# EasyEDA Pro project Ethernet ACS Toggle.eprj

# Schematic Schematic1
Board Name: Board1; Create Date: 2026-02-21; Page Name: P1; Project Name: Ethernet ACS Toggle; Schematic Name: Schematic1; Update Date: 2026-02-20; Company: EasyEDA.com; Page Size: A4; Version: V1.0
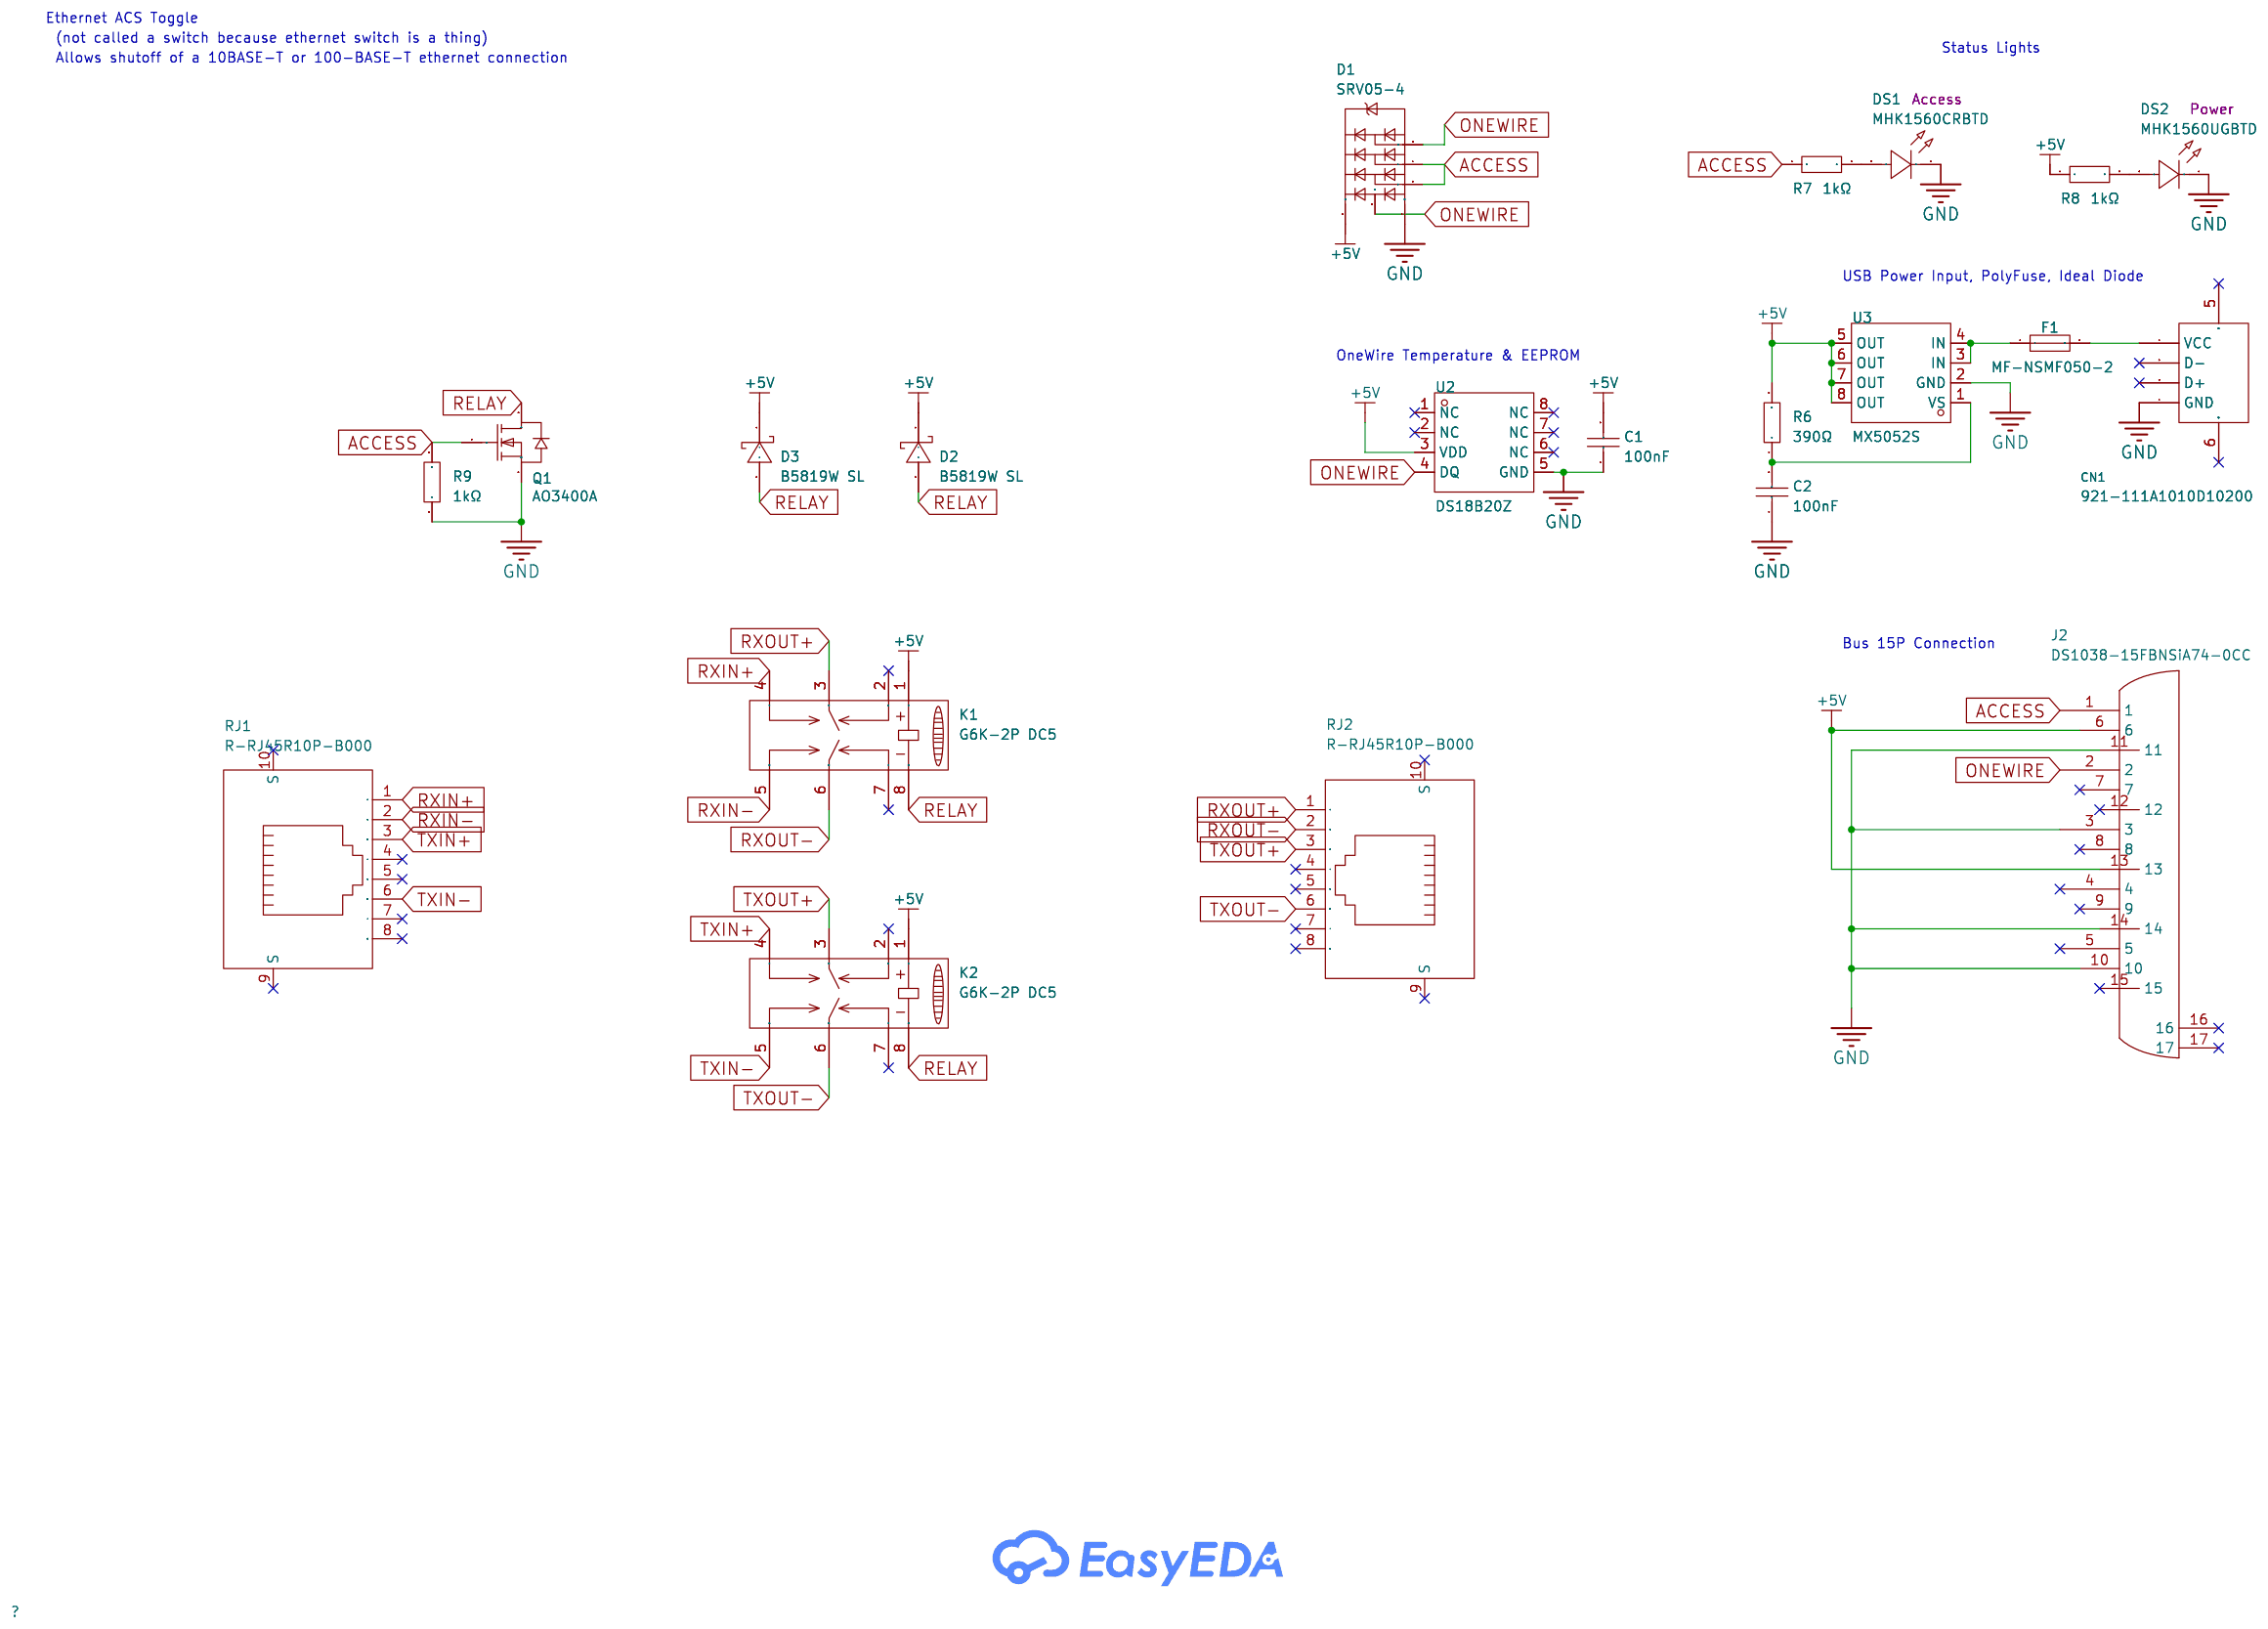
[diagram p0: schematic sheet]

## Parts
C1  100nF  [C0805]
C2  100nF  [C0805]
CN1  921-111A1010D10200  [USB-B_TH_USB-B-FEMALE-90]
D1  SRV05-4  [SOT-23-6_L2.9-W1.6-P0.95-LS2.8-BL-1]
D2  B5819W SL  [SOD-123_L2.7-W1.6-LS3.7-RD-1]
D3  B5819W SL  [SOD-123_L2.7-W1.6-LS3.7-RD-1]
DS1  MHK1560CRBTD  [LED-TH_MHK1560UGBTD]
DS2  MHK1560UGBTD  [LED-TH_MHK1560UGBTD]
F1  MF-NSMF050-2  [F1206]
J2  DS1038-15FBNSiA74-0CC  [DSUB-TH_DS1038-15FBNSIA74-0CC]
K1  G6K-2P DC5  [RELAY-TH_G6K-2P]
K2  G6K-2P DC5  [RELAY-TH_G6K-2P]
Q1  AO3400A  [SOT-23-3_L2.9-W1.3-P1.90-LS2.4-BR]
R6  390Ω  [R0805]
R7  1kΩ  [R0805]
R8  1kΩ  [R0805]
R9  1kΩ  [R0805]
RJ1  R-RJ45R10P-B000  [RJ45-TH_R-RJ45R10P-B000]
RJ2  R-RJ45R10P-B000  [RJ45-TH_R-RJ45R10P-B000]
U2  DS18B20Z  [SOP-8_L4.9-W3.9-P1.27-LS6.0-BL]
U3  MX5052S  [SOP-8_L4.9-W3.9-P1.27-LS6.0-BL]

## Library data of the parts
C1 C2 = CL21B104KCFNNNE: Capacitance:100nF Tolerance:±10% Tolerance:±10% Voltage Rating:100V Temperature Coefficient:X7R; LCSC Part Name: 100nF ±10% 100V; Supplier Part: C28233; Manufacturer: SAMSUNG(三星); Supplier Footprint: 0805; JLCPCB Part Class: Basic Part; Datasheet: https://item.szlcsc.com/datasheet/CL21B104KCFNNNE/28983.html; Supplier: LCSC; Tolerance: ±10%; Voltage Rating: 100V; Temperature Coefficient: X7R
CN1 = 921-111A1010D10200: Connector Type:Type-B Protocol Standard:USB 2.0 Gender:Female Mounting Type:Right Angle Number of Contacts:4P Number of Ports:1 Length:16.3mm Detection color:White; LCSC Part Name: Type-B 母 弯插; Supplier Part: C46392; Manufacturer: 精拓金; Supplier Footprint: 插件; Datasheet: https://item.szlcsc.com/datasheet/921-111A1010D10200/47396.html; Supplier: LCSC; Connector Type: Type-B; Protocol Standard: USB 2.0; Gender: Female; Mounting Type: Right Angle; Number of Contacts: 4P; Number of Ports: 1; Length: 16.3mm; Detection color: White
D1 = SRV05-4_C7420376: LCSC Part Name: 丝印 V05 双向ESD 5V截止 峰值浪涌电流：5A; Supplier Part: C7420376; Manufacturer: R+O(宏嘉诚); Supplier Footprint: SOT-23-6L; Datasheet: https://item.szlcsc.com/datasheet/SRV05-4/8397198.html; Supplier: LCSC; Polarity: Unidirectional; Reverse Stand-Off Voltage (Vrwm): 5V; Clamping Voltage: 15V; Peak Pulse Current (Ipp): 4A; Peak Pulse Power Dissipation (Ppp): 80W; Voltage - Breakdown: 6V; Reverse Leakage Current (Ir): 5uA; Number of Channels: 4; Operating Temperature: -55℃~+150℃; level of protection: IEC 61000-4-2；IEC 61000-4-5; Type: ESD; Junction Capacitance: 1pF
D2 D3 = B5819W SL: LCSC Part Name: 电压:40V 电流:1A; Supplier Part: C8598; Manufacturer: CJ(江苏长电/长晶); Supplier Footprint: SOD-123; Datasheet: https://item.szlcsc.com/datasheet/B5819W%2520SL/9093.html; Supplier: LCSC; Voltage - Forward(Vf@If): 600mV@1A; Voltage - DC Reverse(Vr): 40V; Current - Rectified: 1A; Non-Repetitive Peak Forward Surge Current: 9A
DS1 = MHK1560CGBTD: 20mA 雾状红透镜 50mcd -40℃~+85℃ 632nm Red 85° 1.75V~2.2V Plugin,P=2.54mm Light Emitting Diodes (LED) ROHS; LCSC Part Name: 1560直插单灯翠绿色光; Supplier Part: C7470835; Manufacturer: MEIHUA(美华); Supplier Footprint: 插件,P=2.54mm; JLCPCB Part Class: Extended Part; Datasheet: https://atta.szlcsc.com/upload/public/pdf/source/20231114/0151DB1F997DCF286213A722D08B4BAA.pdf; Supplier: LCSC; Emitted Color: Red; Forward Voltage (VF): 1.75V~2.2V; Forward Current: 20mA; Dominant Wavelength: 520nm; Lens Color: 雾状绿透镜; Luminous Intensity: 1000mcd; Viewing Angle: 85°; Operating Temperature: -40℃~+85℃; Note: Access
DS2 = MHK1560UGBTD: Emitted Color:Emerald Forward Voltage (VF):1.75V~2.2V Forward Voltage (VF):1.75V~2.2V Forward Current:20mA Dominant Wavelength:520nm Dominant Wavelength:520nm Lens Color:雾状绿透镜 Luminous Intensity:1000mcd Luminous Intensity:1000mcd Viewing Angle:85° Operati; LCSC Part Name: 1560直插单灯翠绿色光; Supplier Part: C7470833; Manufacturer: MEIHUA(美华); Supplier Footprint: 插件,P=2.54mm; JLCPCB Part Class: Extended Part; Datasheet: https://atta.szlcsc.com/upload/public/pdf/source/20231114/0151DB1F997DCF286213A722D08B4BAA.pdf; Supplier: LCSC; Emitted Color: Emerald; Forward Voltage (VF): 1.75V~2.2V; Forward Current: 20mA; Dominant Wavelength: 520nm; Lens Color: 雾状绿透镜; Luminous Intensity: 1000mcd; Viewing Angle: 85°; Operating Temperature: -40℃~+85℃; Note: Power
F1 = MF-NSMF050-2: Voltage - Max:- Current - Max:- Hold Current:- Trip Current:- Resistance - Initial (Ri) (Min):150mΩ Resistance - Post Trip (R1) (Max):700mΩ Time to Trip(Max):- Operating Temperature:-40℃~+85℃ Operating Temperature:-40℃~+85℃ Length:- Width:- Height:- Pitch; LCSC Part Name: 0.5A 13.2V 自恢复保险丝; Supplier Part: C75464; Manufacturer: BOURNS; Supplier Footprint: 1206; Datasheet: https://item.szlcsc.com/datasheet/MF-NSMF050-2/76588.html; Supplier: LCSC; Resistance - Initial (Ri) (Min): 150mΩ; Resistance - Post Trip (R1) (Max): 700mΩ; Operating Temperature: -40℃~+85℃
J2 = DS1038-15FBNSiA74-0CC: Connector Type:High Density D-Sub Gender:Female Number of Pins:15P Mounting Type:Right Angle Number of Rows:3 Current Rating-Signal:3A Current Rating-Power:- Voltage Rating:- Color:Black Operating Temperature:-40℃~+105℃ Operating Temperature:-40℃~+105℃; LCSC Part Name: 黑色 1000/盒 D-Sub 母 P数:15P; Supplier Part: C75754; Manufacturer: CONNFLY; Supplier Footprint: 弯插; JLCPCB Part Class: Extended Part; Datasheet: https://item.szlcsc.com/datasheet/DS1038-15FBNSiA74-0CC/76880.html; Supplier: LCSC; Connector Type: High Density D-Sub; Gender: Female; Number of Pins: 15P; Mounting Type: Right Angle; Number of Rows: 3; Current Rating-Signal: 3A; Color: Black; Operating Temperature: -40℃~+105℃
K1 K2 = G6K-2P DC5: LCSC Part Name: 5V 1A 两组转换:2C(双刀双掷转换); Supplier Part: C397137; Manufacturer: OMRON(欧姆龙); Supplier Footprint: DIP,10x6.5mm; JLCPCB Part Class: Extended Part; Datasheet: https://item.szlcsc.com/datasheet/G6K-2P%2520DC5/378724.html; Supplier: LCSC; Coil Voltage: 5V; Contact Form: Two groups of conversions: 2C(Double-pole double-throw conversion); Contact Rating: 300mA@125VAC；1A@30VDC; Switching Voltage(Max): 60V@DC；125V@AC; Contact Material: Silver + Gold Plated; Coil Rated Power: 100mW; Coil Resistance: 237Ω; Switching Current(Max): 1A; Operate Time: 3ms; Release Time: 3ms; Contact Resistance: 100mΩ; Operating Temperature: -40℃~+70℃
Q1 = AO3400A_C20917: LCSC Part Name: 1个N沟道 耐压:30V 电流:5.7A; Supplier Part: C20917; Manufacturer: AOS; Supplier Footprint: SOT-23-3L; Datasheet: https://item.szlcsc.com/datasheet/AO3400A/21629.html; Supplier: LCSC; Drain to Source Voltage: 30V; RDS(on): 48mΩ@2.5V; Gate Threshold Voltage (Vgs(th)): 1.45V@250uA; Gate Charge(Qg): 7nC@10V; Input Capacitance(Ciss): 630pF@15V; Operating Temperature: -55℃~+150℃@(Tj); Type: N-Channel
R6 = 0805W8F3900T5E: Type:Thick Film Resistor Resistance:390Ω Tolerance:±1% Tolerance:±1% Power(Watts):125mW Voltage-Supply(Max):150V Temperature Coefficient:±100ppm/℃ Temperature Coefficient:±100ppm/℃ Operating Temperature:-55℃~+155℃ Operating Temperature:-55℃~+155℃; LCSC Part Name: 390Ω ±1% 125mW 厚膜电阻; Supplier Part: C17655; Manufacturer: UNI-ROYAL(厚声); Supplier Footprint: 0805; Datasheet: https://item.szlcsc.com/datasheet/0805W8F3900T5E/18343.html; Supplier: LCSC; Type: Thick Film Resistor; Tolerance: ±1%; Power(Watts): 125mW; Voltage-Supply(Max): 150V; Temperature Coefficient: ±100ppm/℃; Operating Temperature: -55℃~+155℃
R7-R9 = 0805W8F1001T5E: Type:Thick Film Resistors Resistance:1kΩ Tolerance:±1% Tolerance:±1% Power(Watts): Overload Voltage (Max): Temperature Coefficient:±100ppm/℃ Temperature Coefficient:±100ppm/℃ Operating Temperature Range:-55℃~+155℃ Operating Temperature Range:-55℃~+155℃; LCSC Part Name: 1kΩ ±1% 125mW 厚膜电阻; Supplier Part: C17513; Manufacturer: UNI-ROYAL(厚声); Supplier Footprint: 0805; Datasheet: https://atta.szlcsc.com/upload/public/pdf/source/20200306/C422600_1E6D84923E4A46A82E41ADD87F860B5C.pdf; Supplier: LCSC; Type: Thick Film Resistors; Tolerance: ±1%; Temperature Coefficient: ±100ppm/℃; Operating Temperature Range: -55℃~+155℃
RJ1 RJ2 = R-RJ45R10P-B000: LCSC Part Name: 弯插 不带LED; Supplier Part: C386758; Manufacturer: Ckmtw(灿科盟); Supplier Footprint: 弯插; Datasheet: https://item.szlcsc.com/datasheet/R-RJ45R10P-B000/360865.html; Supplier: LCSC; Connector Type: RJ45 Jack; Mounting Type: Right Angle; Number of Ports: 1; LED: Non-LED; Shielding: Shielded; Supplementary Features: Harpoon Contact (Plastic); Contact Material: Phosphor Bronze; Contact Plating: Gold; Operating Temperature: 0℃~+70℃
U2 = DS18B20Z: Resolution:±0.4℃ Resolution:±0.4℃ Supply Voltage:2.5V~5.5V Supply Voltage:2.5V~5.5V; LCSC Part Name: 温度传感器; Supplier Part: C695837; Manufacturer: UMW(友台半导体); Supplier Footprint: SOIC-8; JLCPCB Part Class: Extended Part; Datasheet: https://atta.szlcsc.com/upload/public/pdf/source/20231109/DC3DA9D47D486EF40A6E0F08B9A498E3.pdf; Supplier: LCSC; Resolution: ±0.4℃; Supply Voltage: 2.5V~5.5V
U3 = MX5052S: LCSC Part Name: 集成MOS Oring控制器; Supplier Part: C5875696; Manufacturer: Wuxi Maxinmicro(无锡明芯微); Supplier Footprint: SOP-8; JLCPCB Part Class: Extended Part; Datasheet: https://item.szlcsc.com/datasheet/MX5052S/6809525.html; Supplier: LCSC

## Nets
+5V: C1.2 D1.5 D2.1(-) D3.1(-) J2.6 J2.13 K1.1 K2.1 R6.2 R8.1 U2.3(VDD) U3.5(OUT) U3.6(OUT) U3.7(OUT) U3.8(OUT)
GND: C1.1 C2.1 CN1.4(GND) D1.2 DS1.1(K) DS2.1(K) J2.3 J2.10 J2.11 J2.14 Q1.2(S) R9.1 U2.5(GND) U3.2(GND)
ACCESS: D1.3 D1.4 J2.1 Q1.1(G) R7.1 R9.2
ONEWIRE: D1.1 D1.6 J2.2 U2.4(DQ)
RELAY: D2.2(+) D3.2(+) K1.8 K2.8 Q1.3(D)
RXIN+: K1.4 RJ1.1
RXIN-: K1.5 RJ1.2
RXOUT+: K1.3 RJ2.1
RXOUT-: K1.6 RJ2.2
TXIN+: K2.4 RJ1.3
TXIN-: K2.5 RJ1.6
TXOUT+: K2.3 RJ2.3
TXOUT-: K2.6 RJ2.6
$1N464: DS1.2(A) R7.2
$1N467: DS2.2(A) R8.2
$1N875: CN1.1(VCC) F1.2
$1N876: F1.1 U3.3(IN) U3.4(IN)
$1N878: C2.2 R6.1 U3.1(VS)

Not connected (* = marked no-connect by the designer): CN1 2(D-)* 3(D+)* 5(SH1)* 6(SH2)*; J2 4* 5* 7* 8* 9* 12* 15* 16* 17*; K1 2* 7*; K2 2* 7*; RJ1 4* 5* 7* 8* 9(S)* 10(S)*; RJ2 4* 5* 7* 8* 9(S)* 10(S)*; U2 1(NC)* 2(NC)* 6(NC)* 7(NC)* 8(NC)*

## Notes on the sheet
- Ethernet ACS Toggle
- (not called a switch because ethernet switch is a thing)
- Allows shutoff of a 10BASE-T or 100-BASE-T ethernet connection
- Status Lights
- USB Power Input, PolyFuse, Ideal Diode
- OneWire Temperature & EEPROM
- Bus 15P Connection

# Board PCB1
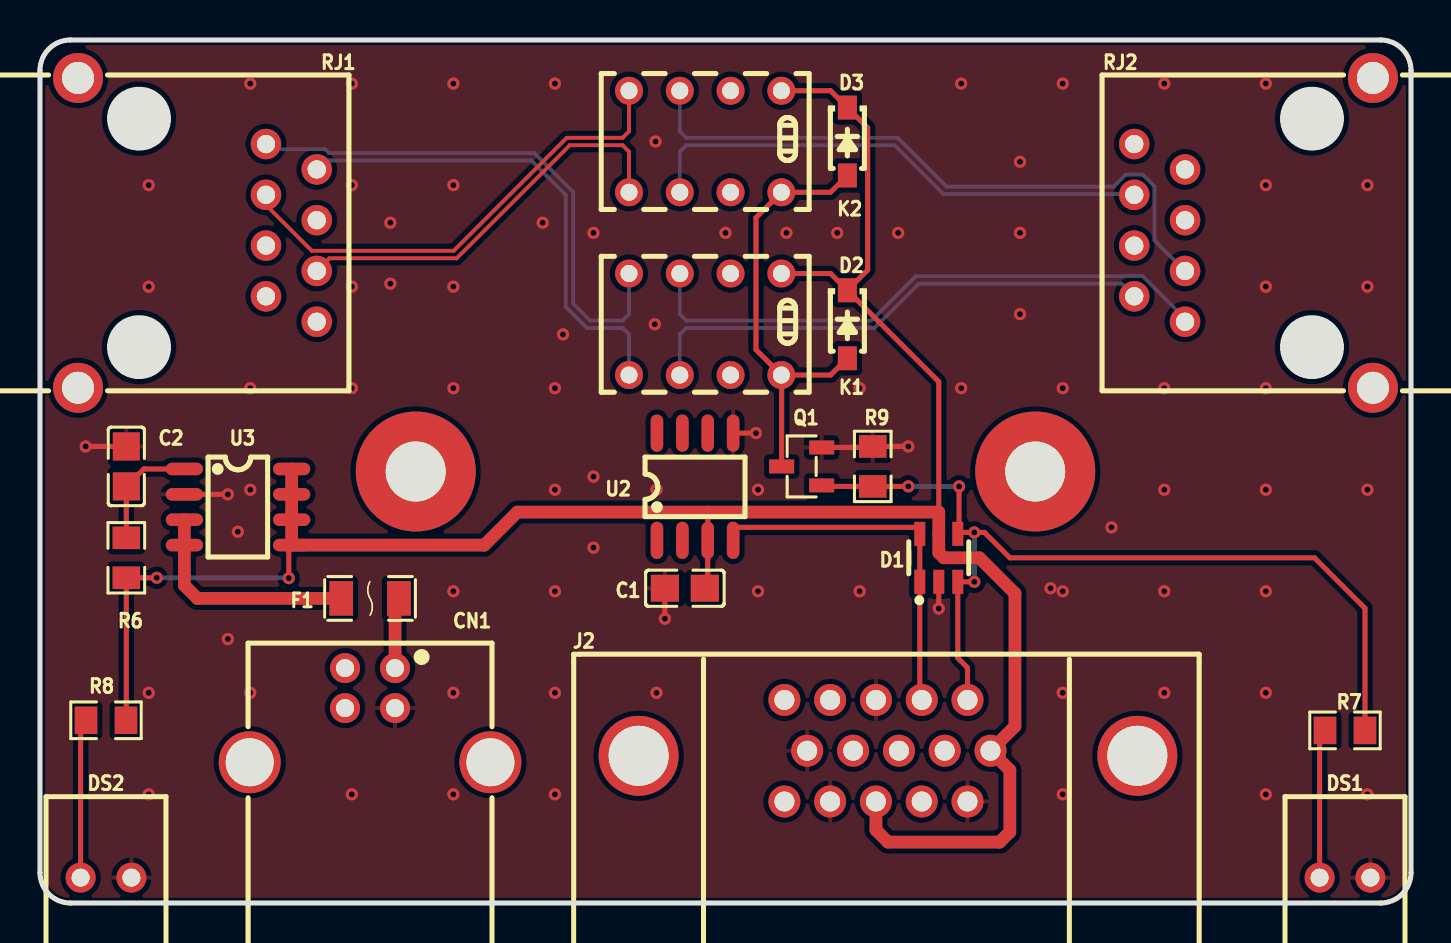
[diagram p1: board, top side]
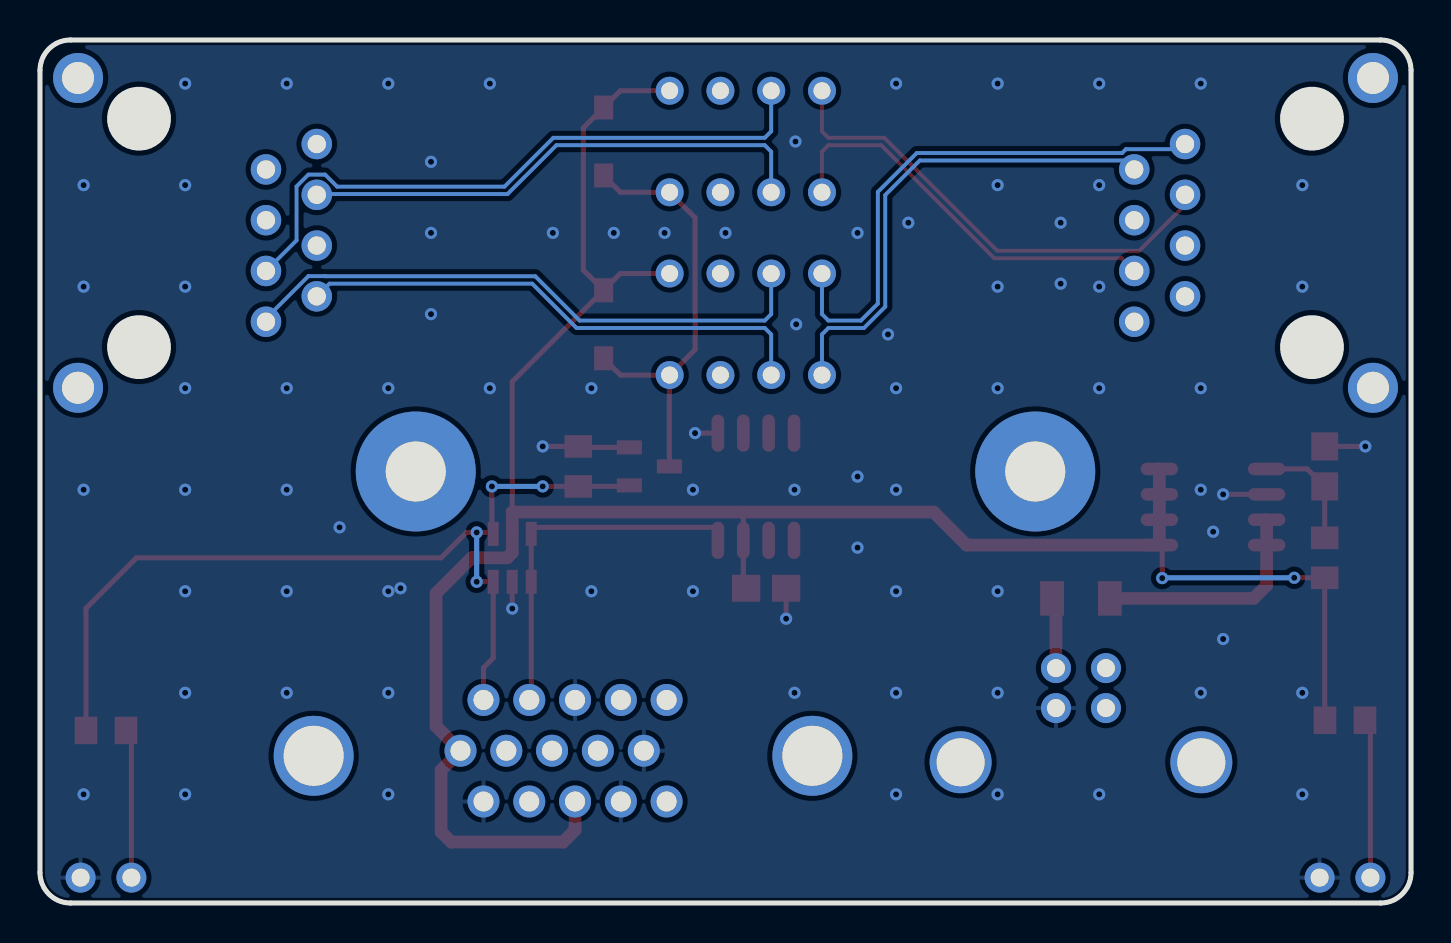
[diagram p2: board, bottom side, seen from below]

Outline 68.58 x 43.18 mm; copper layers: Top Layer, Inner1, Inner2, Bottom Layer. Coordinates in mm from the lower left corner of the outline.
Outline path: 0,41.66 0,1.52 arc(0.45,0.45) 1.52,0 67.06,0 arc(68.13,0.45) 68.58,1.52 68.58,41.66 arc(68.13,42.73) 67.06,43.18 1.52,43.18 arc(0.45,42.73) 0,41.66
Stack: Top Layer 0.035mm Outer layer thickness 1oz / Dielectric1 0.2104mm 7628 RC49% 8.6mil / Inner1 0.0152mm Inner layer thickness / Dielectric2 1.065mm 1.1mm H/HOZ Copper / Inner2 0.0152mm Inner layer thickness / Dielectric3 0.2104mm 7628 RC49% 8.6mil / Bottom Layer 0.035mm Outer layer thickness 1oz

## Design rules (mm)
net RXIN-: DP1
net RXIN+: DP1
net RXOUT+: DP4
net TXOUT-: DP3
net TXIN-: DP2
net TXIN+: DP2
net TXOUT+: DP3
net RXOUT-: DP4
template: Custom Config
spacing copperThickness1oz (default): track to track 0.102, other pairs 0.152 to 0.3
spacing copperThickness2oz: track to track 0.203, other pairs 0.152 to 0.3
track width copperThickness1oz (default): min 0.127, default 0.254, max 2.54
track width copperThickness2oz: min 0.203, default 0.254, max 2.54
differential pair Ethernet (default): width min 0.193, default 0.193, max 0.193; gap min 0.178, default 0.178
via viaSize (default): diameter min 0.5, default 0.61, max 10; hole min 0.3, default 0.305, max 6.3

## Placement (name value [footprint] x y rotation side)
C1  100nF  [C0805]  32.26 15.75 0 top
C2  100nF  [C0805]  4.32 21.84 270 top
CN1  921-111A1010D10200  [USB-B_TH_USB-B-FEMALE-90]  16.51 9.4 0 top
D1  SRV05-4  [SOT-23-6_L2.9-W1.6-P0.95-LS2.8-BL-1]  44.96 17.27 0 top
D2  B5819W SL  [SOD-123_L2.7-W1.6-LS3.7-RD-1]  40.39 28.96 270 top
D3  B5819W SL  [SOD-123_L2.7-W1.6-LS3.7-RD-1]  40.39 38.1 270 top
DS1  MHK1560CRBTD  [LED-TH_MHK1560UGBTD]  65.28 1.27 0 top
DS2  MHK1560UGBTD  [LED-TH_MHK1560UGBTD]  3.3 1.27 0 top
F1  MF-NSMF050-2  [F1206]  16.51 15.24 0 top
J2  DS1038-15FBNSiA74-0CC  [DSUB-TH_DS1038-15FBNSIA74-0CC]  42.42 7.62 0 top
K1  G6K-2P DC5  [RELAY-TH_G6K-2P]  33.27 28.96 180 top
K2  G6K-2P DC5  [RELAY-TH_G6K-2P]  33.27 38.1 180 top
NOREF  -  [Pad_e184]  18.8 21.59 0 top
NOREF#2  -  [Pad_e186]  49.78 21.59 0 top
Q1  AO3400A  [SOT-23-3_L2.9-W1.3-P1.90-LS2.4-BR]  38.1 21.84 0 top
R6  390Ω  [R0805]  4.32 17.27 270 top
R7  1kΩ  [R0805]  65.28 8.64 180 top
R8  1kΩ  [R0805]  3.3 9.14 180 top
R9  1kΩ  [R0805]  41.66 21.84 270 top
RJ1  R-RJ45R10P-B000  [RJ45-TH_R-RJ45R10P-B000]  7.87 33.53 90 top
RJ2  R-RJ45R10P-B000  [RJ45-TH_R-RJ45R10P-B000]  60.71 33.53 270 top
U2  DS18B20Z  [SOP-8_L4.9-W3.9-P1.27-LS6.0-BL]  32.77 20.83 0 top
U3  MX5052S  [SOP-8_L4.9-W3.9-P1.27-LS6.0-BL]  9.91 19.81 270 top

## Footprints (pads in the part's own frame, mm; a bottom-side part is the same pattern mirrored in y, then rotated)
C0805
  rect 1.41x1.35 smd: 1(-1,0) 2(1,0)
DSUB-TH_DS1038-15FBNSIA74-0CC
  round 1.6 hole 1: 1(3.978,2.54) 2(1.688,2.54) 3(-0.603,2.54) 4(-2.893,2.54) 5(-5.182,2.54) 6(5.128,0) 7(2.837,0) 8(0.548,0) 9(-1.743,0) 10(-4.042,0) 11(3.978,-2.54) 12(1.688,-2.54) 13(-0.603,-2.54) 14(-2.893,-2.54) 15(-5.182,-2.54)
  round 4 hole 3: 16(12.473,-0.254) 17(-12.473,-0.254)
F1206
  rect 1.19x1.728 smd: 1(-1.445,0) 2(1.445,0)
LED-TH_MHK1560UGBTD
  round 1.5 hole 0.9: 1(1.27,0) 2(-1.27,0)
Pad_e184
  round 6 hole 3: 1(0,0)
Pad_e186
  round 6 hole 3: 1(0,0)
R0805
  rect 1.133x1.377 smd: 1(-1,0) 2(1,0)
RELAY-TH_G6K-2P
  round 1.4 hole 0.85: 1(-3.81,-2.54) 2(-1.27,-2.54) 3(1.27,-2.54) 4(3.81,-2.54) 5(3.81,2.54) 6(1.27,2.54) 7(-1.27,2.54) 8(-3.81,2.54)
RJ45-TH_R-RJ45R10P-B000
  round 1.524 hole 0.914: 1(4.445,-3.43) 2(3.175,-5.97) 3(1.905,-3.43) 4(0.635,-5.97) 5(-0.635,-3.43) 6(-1.905,-5.97) 7(-3.175,-3.43) 8(-4.445,-5.97)
  round 2.5 hole 1.6: 9(7.75,5.97) 10(-7.75,5.97)
SOD-123_L2.7-W1.6-LS3.7-RD-1
  rect 1.2x0.95 smd: 1(-1.7,0) 2(1.7,0)
SOP-8_L4.9-W3.9-P1.27-LS6.0-BL
  oval 0.63x1.865 smd: 1(-1.905,-2.683) 2(-0.635,-2.683) 3(0.635,-2.683) 4(1.905,-2.683) 5(1.905,2.683) 6(0.635,2.683) 7(-0.635,2.683) 8(-1.905,2.683)
SOT-23-3_L2.9-W1.3-P1.90-LS2.4-BR
  rect 1.25x0.7 smd: 1(1,-0.95) 2(1,0.95) 3(-1,0)
SOT-23-6_L2.9-W1.6-P0.95-LS2.8-BL-1
  rect 0.55x1.2 smd: 1(-0.95,-1.2) 2(0,-1.2) 3(0.95,-1.2) 4(0.95,1.2) 5(0,1.2) 6(-0.95,1.2)
USB-B_TH_USB-B-FEMALE-90
  round 1.5 hole 0.9: 1(1.25,2.355) 2(-1.25,2.355) 3(-1.25,0.355) 4(1.25,0.355)
  round 3.1 hole 2.4: 5(-6.02,-2.355) 6(6.02,-2.355)

## Nets
As in the schematic.

Pads without a net: CN1 2 3 5 6; J2 4 5 7 8 9 12 15 16 17; K1 2 7; K2 2 7; NOREF 1; NOREF#2 1; RJ1 4 5 7 8 9 10; RJ2 4 5 7 8 9 10; U2 1 2 6 7 8

## Via types
v1: diameter 0.61, hole 0.305, Top Layer to Bottom Layer, 88 vias

## Routing (per net, layer and track width the routed paths; a pad name or vN(x,y) marks a point on that pad's centre or on a via; arc(x,y) is an arc through that point)
+5V: length 116.1
  Top Layer w0.254: D2.1 39.55,31.5 K1.1 ; D2.1 44.96,26.08 44.96,19.56 ; D2.1 41.4,31.67 41.4,38.78 D3.1 39.55,40.64 K2.1 ; C1.2 33.4,15.89 U2.3 33.4,19.56 ; v1(5.84,16.27) R6.2 4.32,9.16 R8.1 ; v1(12.45,16.26) 12.45,17.76 U3.5
  Top Layer w0.635: U3.8 U3.7 U3.6 U3.5 22.22,17.91 23.88,19.56 44.96,19.56 D1.5 44.96,17.53 45.21,17.27 46.99,17.27 48.77,15.49 48.77,8.84 J2.6 48.51,6.65 48.51,3.56 48.01,3.05 42.42,3.05 41.82,3.65 J2.13
  Bottom Layer w0.254: v1(5.84,16.27) 12.43,16.27 v1(12.45,16.26)
GND: length 12.6
  Top Layer w0.254: U2.5 v1(35.81,23.51) ; v1(43.43,22.84) R9.1 41.61,22.79 Q1.2 ; D1.2 v1(44.96,14.73) ; U3.2 v1(9.4,20.45) ; C1.1 v1(31.26,14.22) ; C2.1 v1(2.29,22.84)
  vias: v1(5.44,35.92) v1(5.44,30.84) v1(5.44,10.52) v1(5.44,5.44) v1(9.4,13.21) v1(9.9,18.58) v1(10.52,41) v1(10.52,25.76) v1(10.52,20.68) v1(10.52,10.52) v1(15.6,41) v1(15.6,35.92) v1(15.6,30.84) v1(15.6,25.76) v1(15.6,5.44) v1(17.53,34.04) v1(17.53,30.99) v1(20.68,41) v1(20.68,35.92) v1(20.68,30.84) v1(20.68,25.76) v1(20.68,15.6) v1(20.68,10.52) v1(20.68,5.44) v1(25.15,34.04) v1(25.76,41) v1(25.76,25.76) v1(25.76,20.68) v1(25.76,15.6) v1(25.76,10.52) v1(25.76,5.44) v1(26.16,28.45) v1(27.69,33.53) v1(27.69,21.34) v1(27.69,17.78) v1(30.79,38.1) v1(30.75,28.96) v1(30.84,20.68) v1(30.84,10.52) v1(34.29,33.53) v1(35.92,20.68) v1(35.92,15.6) v1(37.34,33.53) v1(39.88,33.53) v1(41,25.76) v1(41,15.6) v1(42.93,33.53) v1(46.08,41) v1(46.08,25.76) v1(49.02,37.08) v1(49.02,33.53) v1(49.02,29.46) v1(50.55,15.75) v1(51.16,41) v1(51.16,25.76) v1(51.16,15.6) v1(51.16,10.52) v1(51.16,5.44) v1(53.59,18.8) v1(56.24,41) v1(56.24,25.76) v1(56.24,20.68) v1(56.24,15.6) v1(56.24,10.52) v1(61.32,41) v1(61.32,35.92) v1(61.32,30.84) v1(61.32,25.76) v1(61.32,20.68) v1(61.32,15.6) v1(61.32,10.52) v1(61.32,5.44) v1(66.4,35.92) v1(66.4,30.84) v1(66.4,20.68) v1(66.4,5.44)
ACCESS: length 47.3
  Top Layer w0.254: 66.28,8.13 66.28,14.75 63.75,17.27 48.51,17.27 47.24,18.54 v1(46.74,18.54) 46.04,18.54 45.97,18.47 ; v1(46.74,16.07) D1.3 45.91,12.26 46.4,11.77 J2.1 ; v1(43.43,20.84) R9.2 39.15,20.84 Q1.1 ; 45.97,18.47 D1.4 ; 45.97,18.47 v1(45.97,20.84)
  Bottom Layer w0.254: v1(46.74,16.07) v1(46.74,18.54) ; v1(43.43,20.84) v1(45.97,20.84)
ONEWIRE: length 18.6
  Top Layer w0.254: J2.2 44.01,10.26 D1.1 D1.6 44.01,18.73 43.94,18.8 34.67,18.8 U2.4
RELAY: length 22.1
  Top Layer w0.254: D3.2 39.55,35.56 K2.8 35.81,34.29 35.81,27.69 K1.8 ; Q1.3 37.1,26.4 K1.8 ; K1.8 39.55,26.42 D2.2
RXIN+: length 27.3
  Bottom Layer w0.193: K1.4 29.46,29.46 29.14,29.14 27.52,29.14 26.67,29.99 26.67,35.58 24.72,37.52 14.45,37.52 14.26,37.72 11.56,37.72 RJ1.1
RXIN-: length 24.7
  Bottom Layer w0.193: K1.5 29.46,28.45 29.14,28.77 27.36,28.77 26.3,29.84 26.3,35.42 24.57,37.15 14.29,37.15 RJ1.2
RXOUT+: length 29.4
  Bottom Layer w0.193: K1.3 32,29.46 32.33,29.14 41.59,29.14 43.81,31.36 54.31,31.36 54.32,31.36 55.15,31.36 57.28,29.24 57.28,29.08
RXOUT-: length 26.1
  Bottom Layer w0.193: K1.6 32,28.45 32.33,28.77 41.74,28.77 43.96,30.99 54.1,30.99 RJ2.2
TXIN+: length 24.1
  Top Layer w0.193: K2.4 29.46,38.61 29.14,38.29 26.35,38.29 20.7,32.63 13.59,32.63 11.3,34.92 RJ1.3
TXIN-: length 20.4
  Top Layer w0.193: K2.5 29.46,37.59 29.14,37.91 26.5,37.91 20.84,32.26 14.48,32.26 RJ1.6
TXOUT+: length 32.3
  Bottom Layer w0.193: RJ2.3 55.75,33.15 55.75,35.85 55.15,36.44 54.32,36.44 53.72,35.84 45.35,35.84 42.9,38.29 32.33,38.29 32,38.61 K2.3
TXOUT-: length 25.9
  Bottom Layer w0.193: K2.6 32,37.59 32.33,37.91 42.75,37.91 45.19,35.47 54.7,35.47 RJ2.6
$1N464: length 7.5
  Top Layer w0.254: DS1.2 64.01,8.37 R7.2
$1N467: length 8
  Top Layer w0.254: DS2.2 2.03,8.87 R8.2
$1N875: length 3.6
  Top Layer w0.635: CN1.1 17.76,15.05 F1.2
$1N876: length 11.4
  Top Layer w0.635: U3.3 U3.4 7.22,15.89 7.87,15.24 15.06,15.24
$1N878: length 5.8
  Top Layer w0.254: R6.1 C2.2 5.19,21.72 U3.1

## Copper pours and planes (outline as drawn; the poured copper is in the pictures)
GND on Top Layer: -2.29,46.23 71.88,46.23 71.88,-7.11 -2.29,-7.11
GND on Bottom Layer: -0.76,44.2 70.36,44.2 70.36,-4.57 -0.76,-4.57
GND on Inner1: -0.76,44.7 70.87,44.7 70.87,-3.05 -0.76,-3.05
GND on Inner2: -1.27,44.2 70.36,44.2 70.36,-2.03 -1.27,-2.03
